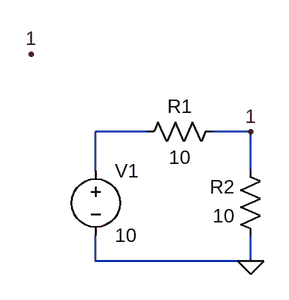
[diagram p0: schematic q1_circuit_1.asc]
q1_circuit_1.asc, the LTspice schematic file:
Version 4
SHEET 1 880 680
WIRE 144 96 80 96
WIRE 272 96 224 96
WIRE 80 144 80 96
WIRE 272 144 272 96
WIRE 80 256 80 224
WIRE 272 256 272 224
WIRE 272 256 80 256
FLAG 272 256 0
FLAG 272 96 1
FLAG 0 0 1
SYMBOL voltage 80 128 R0
SYMATTR InstName V1
SYMATTR Value 10
SYMBOL res 240 80 R90
WINDOW 0 0 56 VBottom 2
WINDOW 3 32 56 VTop 2
SYMATTR InstName R1
SYMATTR Value 10
SYMBOL res 288 240 R180
WINDOW 0 36 76 Left 2
WINDOW 3 36 40 Left 2
SYMATTR InstName R2
SYMATTR Value 10

The netlist it stands for:
* q1_circuit_1.asc
V1 N001 0 10
R1 1 N001 10
R2 0 1 10
.backanno
.end